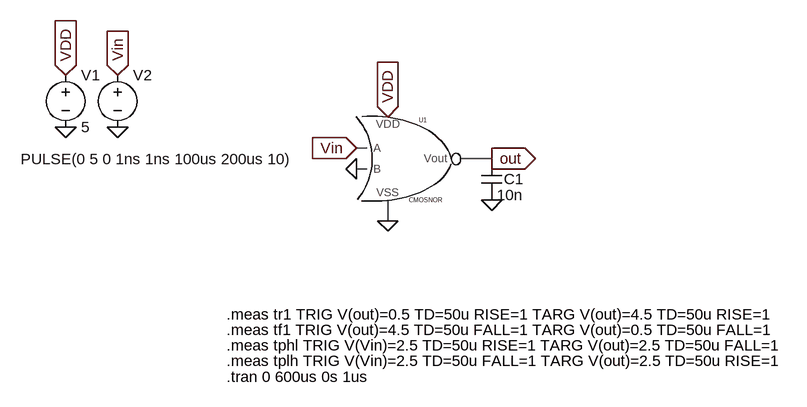
[diagram p0: schematic part_22_NOR_A.asc]
part_22_NOR_A.asc, the LTspice schematic file:
Version 4
SHEET 1 888 680
WIRE 144 240 128 240
WIRE 336 256 288 256
WIRE 144 272 128 272
WIRE 176 352 176 320
FLAG 176 352 0
FLAG -320 128 VDD
IOPIN -320 128 In
FLAG -320 208 0
FLAG -240 208 0
FLAG -240 128 Vin
IOPIN -240 128 In
FLAG 176 192 VDD
IOPIN 176 192 In
FLAG 128 240 Vin
IOPIN 128 240 In
FLAG 336 320 0
FLAG 336 256 out
IOPIN 336 256 Out
FLAG 128 272 0
SYMBOL voltage -320 112 R0
WINDOW 123 0 0 Left 0
WINDOW 39 0 0 Left 0
SYMATTR InstName V1
SYMATTR Value 5
SYMBOL voltage -240 112 R0
WINDOW 3 -149 145 Left 2
SYMATTR Value PULSE(0 5 0 1ns 1ns 100us 200us 10)
SYMATTR InstName V2
SYMBOL cap 320 256 R0
WINDOW 0 35 32 Left 2
SYMATTR InstName C1
SYMATTR Value 10n
SYMBOL AutoGenerated\\CMOSNOR 208 256 R0
SYMATTR InstName U1
TEXT -72 592 Left 2 !.tran 0 600us 0s 1us
TEXT -72 496 Left 2 !.meas tr1 TRIG V(out)=0.5 TD=50u RISE=1 TARG V(out)=4.5 TD=50u RISE=1
TEXT -72 520 Left 2 !.meas tf1 TRIG V(out)=4.5 TD=50u FALL=1 TARG V(out)=0.5 TD=50u FALL=1
TEXT -72 544 Left 2 !.meas tphl TRIG V(Vin)=2.5 TD=50u RISE=1 TARG V(out)=2.5 TD=50u FALL=1
TEXT -72 568 Left 2 !.meas tplh TRIG V(Vin)=2.5 TD=50u FALL=1 TARG V(out)=2.5 TD=50u RISE=1

The netlist it stands for:
* part_22_NOR_A.asc
V1 VDD 0 5
V2 Vin 0 PULSE(0 5 0 1ns 1ns 100us 200us 10)
C1 out 0 10n
XU1 out Vin 0 VDD 0 CMOSNOR  ; pins Vout A B VDD VSS
.tran 0 600us 0s 1us
.meas tr1 TRIG V(out)=0.5 TD=50u RISE=1 TARG V(out)=4.5 TD=50u RISE=1
.meas tf1 TRIG V(out)=4.5 TD=50u FALL=1 TARG V(out)=0.5 TD=50u FALL=1
.meas tphl TRIG V(Vin)=2.5 TD=50u RISE=1 TARG V(out)=2.5 TD=50u FALL=1
.meas tplh TRIG V(Vin)=2.5 TD=50u FALL=1 TARG V(out)=2.5 TD=50u RISE=1
.lib .\CMOSNOR.lib
.backanno
.end

* Results of the author's LTspice run, read from the files saved beside the schematic
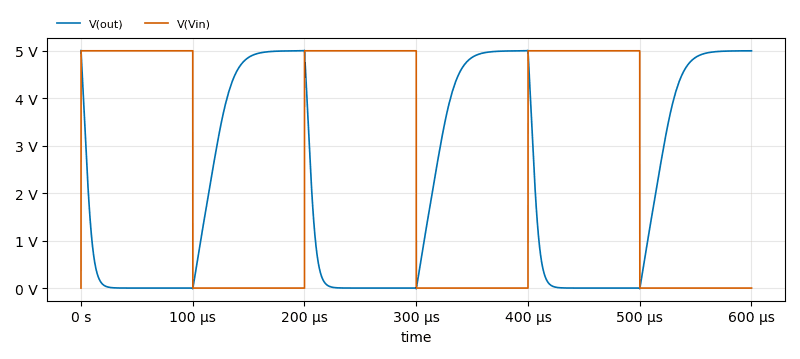
[diagram p1: Transient Analysis of part_22_NOR_A.asc, plotted from the saved traces]
* Transient Analysis, 1 run:
*   V(out): min -15.4 mV, max 5.009 V, average 2.164 V, rms 3.095 V, last 5 V
*   V(Vin): min 0 V, max 5 V, average 2.5 V, rms 3.536 V, last 0 V